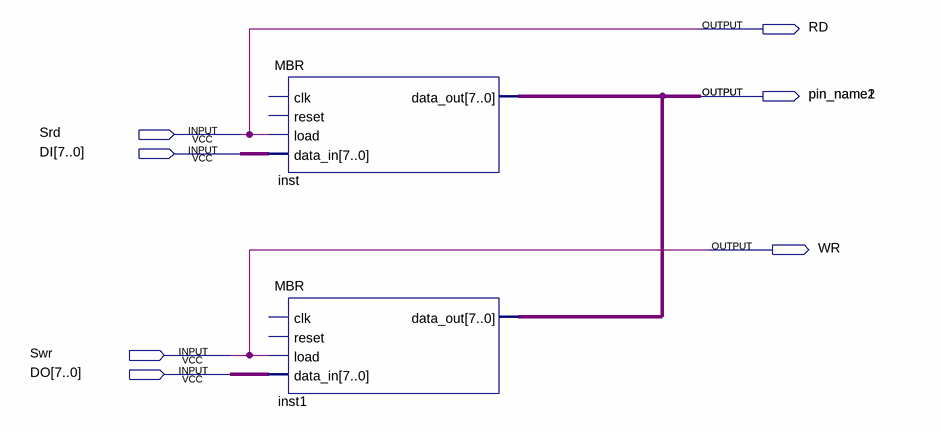
[diagram p0: schematic sheet]
// Quartus schematic MBR1.bdf as structural Verilog: 2 symbols, 8 pins
module MBR1 (
  input  Srd,
  input  [7:0] DI,
  input  Swr,
  input  [7:0] DO,
  output RD,
  output pin_name1,
  output pin_name2,
  output WR
);

  wire [7:0] inst_data_out;

  MBR inst (.load(Srd), .data_in(DI), .data_out(inst_data_out));  // open: clk, reset
  MBR inst1 (.load(Swr), .data_in(DO), .data_out(inst_data_out));  // open: clk, reset

  assign pin_name2 = pin_name1;
  assign RD = Srd;
  assign WR = Swr;
endmodule
